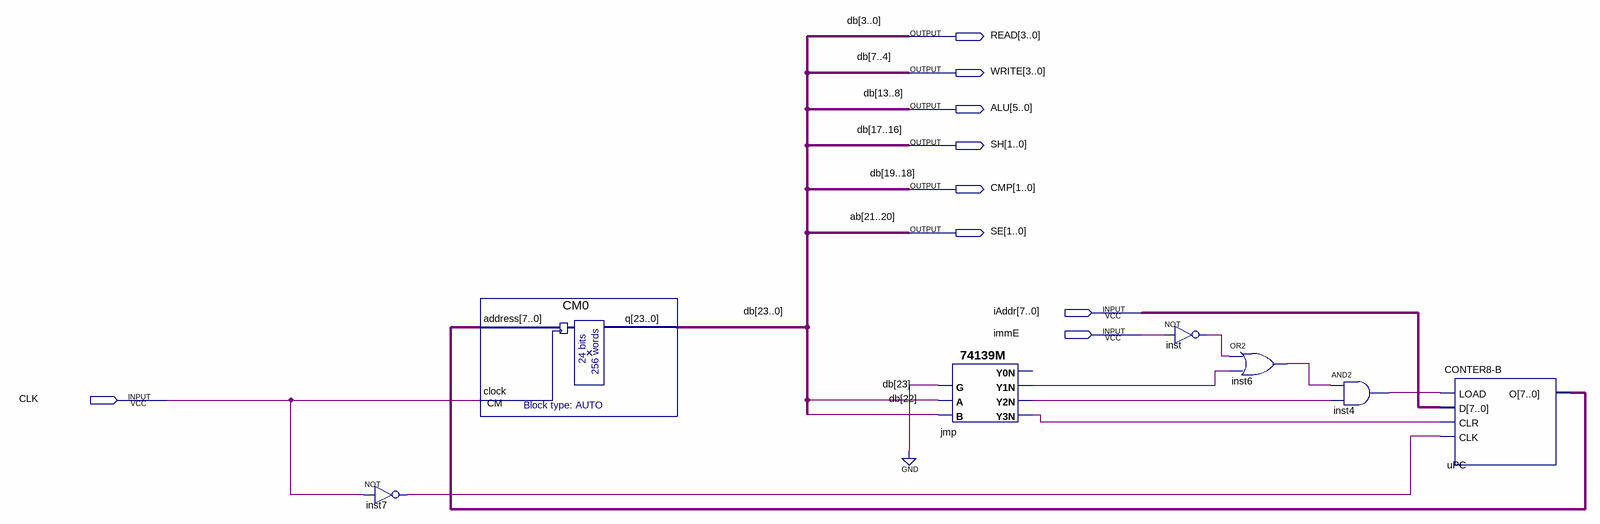
[diagram p0: schematic sheet]
// Quartus schematic CU.bdf as structural Verilog: 7 symbols, 9 pins
module CU (
  input  [7:0] iAddr,
  input  immE,
  input  CLK,
  output [3:0] READ,
  output [3:0] WRITE,
  output [5:0] ALU,
  output [1:0] SH,
  output [1:0] CMP,
  output [1:0] SE
);

  wire inst4_out, inst6_out, inst7_out, inst_out, jmp_y1n, jmp_y2n, jmp_y3n;
  wire [7:0] uPC_o;
  wire [23:14] db;

  not inst7 (inst7_out, CLK);
  CM0 CM (.address(uPC_o), .clock(CLK), .q({db[23:20], CMP, SH, db[15:14], ALU, WRITE, READ}));
  \74139M  jmp (.B(db[22]), .A(db[23]), .G(1'b0), .Y3N(jmp_y3n), .Y2N(jmp_y2n), .Y1N(jmp_y1n));  // open: Y0N
  not inst (inst_out, immE);
  or inst6 (inst6_out, inst_out, jmp_y1n);
  and inst4 (inst4_out, inst6_out, jmp_y2n);
  \CONTER8-B  uPC (.LOAD(inst4_out), .D(iAddr), .CLR(jmp_y3n), .CLK(inst7_out), .O(uPC_o));

  // Other names for the same wires on the sheet: ab[21:20] = SE; db (some bits) = {CMP, SH, ALU, WRITE, READ}
endmodule
